# Altium schematic sheet HELIALights2022V1.0Sheet2.SchDoc
size A3; SheetNumber: 2; SheetTotal: 2
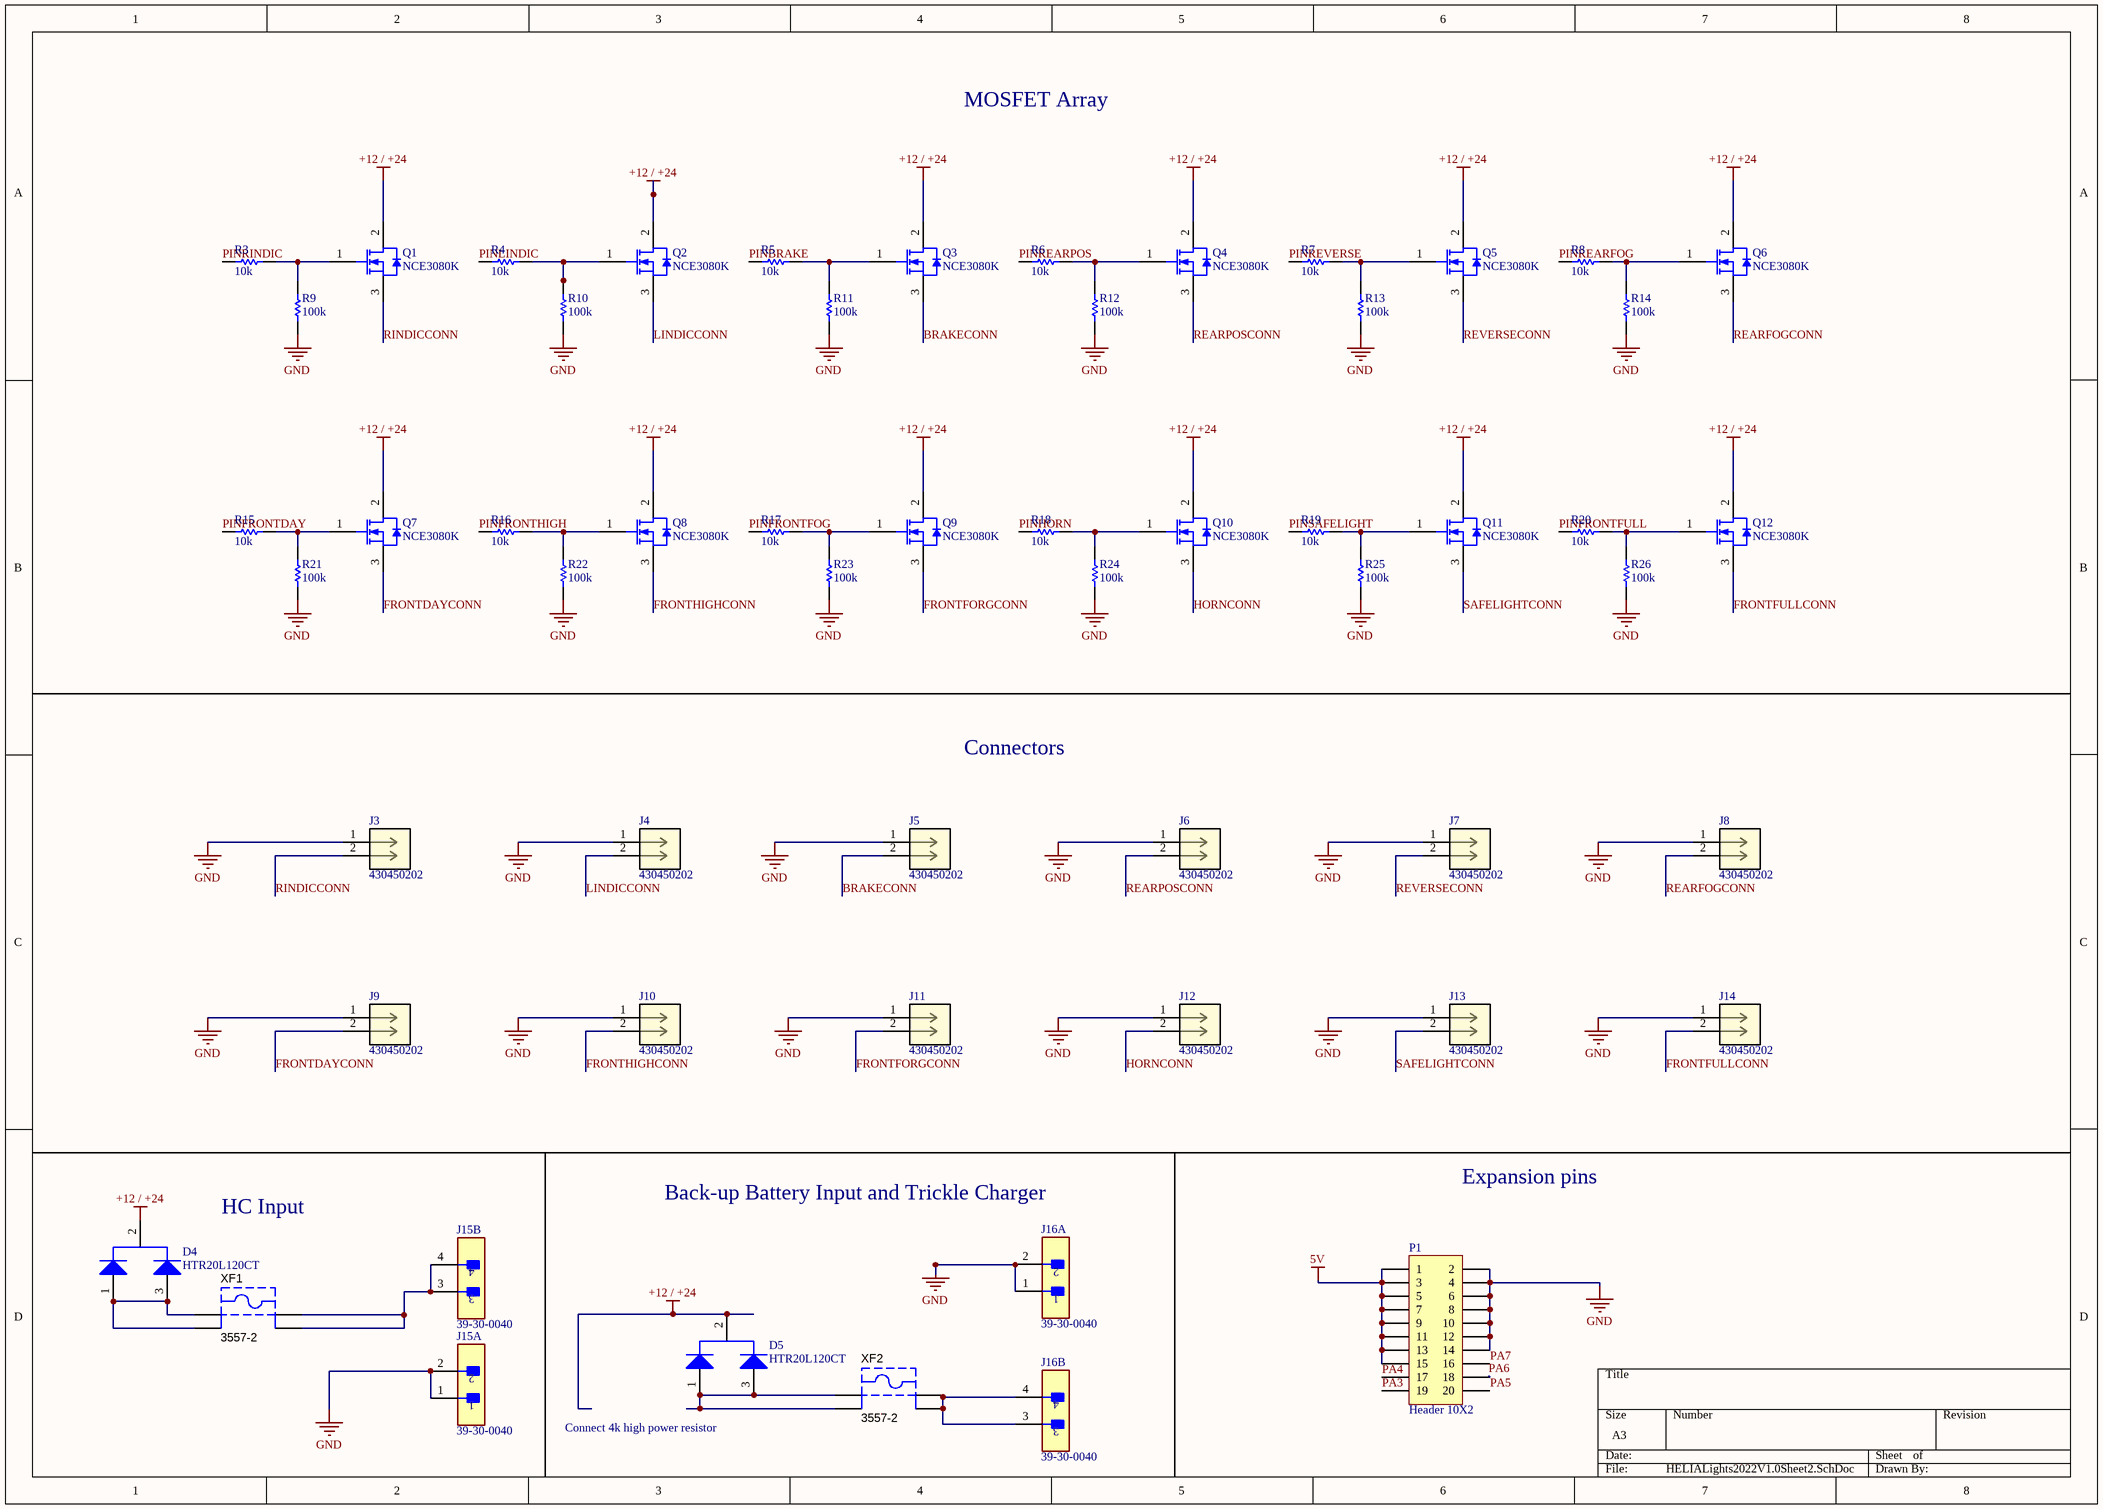
[diagram p0: HELIALights2022V1.0Sheet2.SchDoc]

## Parts
D4  HTR20L120CT  [ONSC-TO-220-3-221A-09]
D5  HTR20L120CT  [ONSC-TO-220-3-221A-09]
J3  430450202  [CON_430450202_MOL]
J4  430450202  [CON_430450202_MOL]
J5  430450202  [CON_430450202_MOL]
J6  430450202  [CON_430450202_MOL]
J7  430450202  [CON_430450202_MOL]
J8  430450202  [CON_430450202_MOL]
J9  430450202  [CON_430450202_MOL]
J10  430450202  [CON_430450202_MOL]
J11  430450202  [CON_430450202_MOL]
J12  430450202  [CON_430450202_MOL]
J13  430450202  [CON_430450202_MOL]
J14  430450202  [CON_430450202_MOL]
J15  39-30-0040  [FP-39-30-0040-MFG]  (parts A,B of 2)
J16  39-30-0040  [FP-39-30-0040-MFG]  (parts A,B of 2)
P1  Header 10X2  [HDR2X10]
Q1  NCE3080K  [INF-PG-TO252-3-313_L]
Q2  NCE3080K  [INF-PG-TO252-3-313_L]
Q3  NCE3080K  [INF-PG-TO252-3-313_L]
Q4  NCE3080K  [INF-PG-TO252-3-313_L]
Q5  NCE3080K  [INF-PG-TO252-3-313_L]
Q6  NCE3080K  [INF-PG-TO252-3-313_L]
Q7  NCE3080K  [INF-PG-TO252-3-313_L]
Q8  NCE3080K  [INF-PG-TO252-3-313_L]
Q9  NCE3080K  [INF-PG-TO252-3-313_L]
Q10  NCE3080K  [INF-PG-TO252-3-313_L]
Q11  NCE3080K  [INF-PG-TO252-3-313_L]
Q12  NCE3080K  [INF-PG-TO252-3-313_L]
R3  10k  [RESC1609X50X30NL8T20]
R4  10k  [RESC1609X50X30NL8T20]
R5  10k  [RESC1609X50X30NL8T20]
R6  10k  [RESC1609X50X30NL8T20]
R7  10k  [RESC1609X50X30NL8T20]
R8  10k  [RESC1609X50X30NL8T20]
R9  100k  [RESC1609X50X30NL8T20]
R10  100k  [RESC1609X50X30NL8T20]
R11  100k  [RESC1609X50X30NL8T20]
R12  100k  [RESC1609X50X30NL8T20]
R13  100k  [RESC1609X50X30NL8T20]
R14  100k  [RESC1609X50X30NL8T20]
R15  10k  [RESC1609X50X30NL8T20]
R16  10k  [RESC1609X50X30NL8T20]
R17  10k  [RESC1609X50X30NL8T20]
R18  10k  [RESC1609X50X30NL8T20]
R19  10k  [RESC1609X50X30NL8T20]
R20  10k  [RESC1609X50X30NL8T20]
R21  100k  [RESC1609X50X30NL8T20]
R22  100k  [RESC1609X50X30NL8T20]
R23  100k  [RESC1609X50X30NL8T20]
R24  100k  [RESC1609X50X30NL8T20]
R25  100k  [RESC1609X50X30NL8T20]
R26  100k  [RESC1609X50X30NL8T20]
XF1  3557-2  [KSTN-3557-2]
XF2  3557-2  [KSTN-3557-2]

## Nets
5V: P1.1 P1.3 P1.5 P1.7 P1.9 P1.11 P1.13 P1.15
+12 / +24: D4.2(K) D5.2(K) Q1.2(DRAIN) Q2.2(DRAIN) Q3.2(DRAIN) Q4.2(DRAIN) Q5.2(DRAIN) Q6.2(DRAIN) Q7.2(DRAIN) Q8.2(DRAIN) Q9.2(DRAIN) Q10.2(DRAIN) Q11.2(DRAIN) Q12.2(DRAIN)
GND: J3.1 J4.1 J5.1 J6.1 J7.1 J8.1 J9.1 J10.1 J11.1 J12.1 J13.1 J14.1 J15.1 J15.2 J16.1 J16.2 P1.2 P1.4 P1.6 P1.8 P1.10 P1.12 P1.14 R9.2 R10.2 R11.2 R12.2 R13.2 R14.2 R21.2 R22.2 R23.2 R24.2 R25.2 R26.2
BRAKECONN: J5.2 Q3.3(SOURCE)
FRONTDAYCONN: J9.2 Q7.3(SOURCE)
FRONTFORGCONN: J11.2 Q9.3(SOURCE)
FRONTFULLCONN: J14.2 Q12.3(SOURCE)
FRONTHIGHCONN: J10.2 Q8.3(SOURCE)
HORNCONN: J12.2 Q10.3(SOURCE)
LINDICCONN: J4.2 Q2.3(SOURCE)
PA3: P1.19
PA4: P1.17
PA5: P1.20
PA6: P1.18
PA7: P1.16
PINBRAKE: R5.2
PINFRONTDAY: R15.2
PINFRONTFOG: R17.2
PINFRONTFULL: R20.2
PINFRONTHIGH: R16.2
PINHORN: R18.2
PINLINDIC: R4.2
PINREARFOG: R8.2
PINREARPOS: R6.2
PINREVERSE: R7.2
PINRINDIC: R3.2
PINSAFELIGHT: R19.2
REARFOGCONN: J8.2 Q6.3(SOURCE)
REARPOSCONN: J6.2 Q4.3(SOURCE)
REVERSECONN: J7.2 Q5.3(SOURCE)
RINDICCONN: J3.2 Q1.3(SOURCE)
SAFELIGHTCONN: J13.2 Q11.3(SOURCE)
NetD4_1: D4.1(A1) D4.3(A2) XF1.1 XF1.2
NetD5_1: D5.1(A1) D5.3(A2) XF2.1 XF2.2
NetJ15_3: J15.3 J15.4 XF1.3 XF1.4
NetJ16_3: J16.3 J16.4 XF2.3 XF2.4
NetQ1_1: Q1.1(GATE) R3.1 R9.1
NetQ2_1: Q2.1(GATE) R4.1 R10.1
NetQ3_1: Q3.1(GATE) R5.1 R11.1
NetQ4_1: Q4.1(GATE) R6.1 R12.1
NetQ5_1: Q5.1(GATE) R7.1 R13.1
NetQ6_1: Q6.1(GATE) R8.1 R14.1
NetQ7_1: Q7.1(GATE) R15.1 R21.1
NetQ8_1: Q8.1(GATE) R16.1 R22.1
NetQ9_1: Q9.1(GATE) R17.1 R23.1
NetQ10_1: Q10.1(GATE) R18.1 R24.1
NetQ11_1: Q11.1(GATE) R19.1 R25.1
NetQ12_1: Q12.1(GATE) R20.1 R26.1

## Notes on the sheet
- MOSFET Array
- Connectors
- Expansion pins
- HC Input
- Back-up Battery Input and Trickle Charger
- Connect 4k high power resistor

## Library data of the parts
D4 D5 = CMP-1055-00618-1: SWITCHMODE(TM) Power Rectifier, 60 V, 30 A, 3-Pin TO-220, Pb-Free, Tube; Manufacturer: On Semiconductor; PartNumber: MBR30H60CTG; Configuration: Common Cathode; IFSM Max (A): 260; RoHS: TRUE; Packing: Tube; ComponentLink3Description: Package Specification; PackageVersion: Rev. AG, 09/2011; DatasheetVersion: Rev. 10; PackageDescription: 3-Pin Flange Mount, Vertical Straight Lead, Body 9.97 x 4.445 mm, Pitch 2.54 mm; ComponentLink1Description: Manufacturer URL; ComponentLink1URL: http://www.onsemi.com/; Mounting Technology: Through Hole; ComponentLink2Description: Datasheet; ComponentLink3URL: http://www.onsemi.com/pub_link/Collateral/221A-09.PDF; ComponentLink2URL: http://www.onsemi.cn/pub_link/Collateral/MBRB30H60CT-D.PDF; PackageReference: TO-220-3-221A-09
J3-J14 = 430450202: No Description Available; Mfr_Name: Molex Connector Corporation; Copyright: Copyright (C) 2022 Ultra Librarian. All rights reserved.; Manufacturer_Part_Number: 430450202; RefDes: RefDes; Type: DEV
J15 J16 = CMP-2000-05600-2: CONN HEADER R/A 4POS 4.2MM; Manufacturer: Molex; Current Rating: 13A; Voltage Rating: 600V; Number Of Contacts: 4; Standoff Height: 0.4mm; Conn Orientation: Right Angle; Conn Gender: Male; Device Class L1: Connectors; Pitch: 4.2mm; Package: 39-30-0040; Octopart: https://octopart.com/39-30-0040-molex-277428; Mouser Description: Headers & Wire Housings 4 CKT R/A HEADER; Temperature Range High: +105°C; Number Of Rows: 2; ComponentLink2Description: Datasheet; ComponentLink2URL: https://www.molex.com/webdocs/datasheets/pdf/en-us/0039300040_PCB_HEADERS.pdf; Manufacturer Part Number: 39-30-0040; Contact Material: Gold,Nickel; Digikey Description: CONN HEADER R/A 4POS 4.2MM; Temperature: -40°C to +105°C; Automotive: No; Device Class L2: Headers and Wire Housings; RoHS: TRUE; Lead Free: Yes; Device Class L3: unset; Category: Conn; Footprint Url: https://www.molex.com/pdm_docs/sd/039300040_sd.pdf; Temperature Range Low: -40°C
P1 = Header 10X2: Header, 10-Pin, Dual row; LatestRevisionDate: 17-Jul-2002; LatestRevisionNote: Re-released for DXP Platform.; Publisher: Altium Limited
Q1-Q12 = CMP-1164-00349-1: N-Channel CoolMOS E6 Power-Transistor, 600 V VDS, 7.3 A ID, -55 to 150 degC, PG-TO252-3-313, Reel, Green; Manufacturer: Infineon; PartNumber: IPD60R600C6; IDpuls (max): 19Â A; VDS (max): 600Â V; VGS(th) (min): 2.5Â V; Ptot (max): 63Â W; Rth: 2Â K/W; VGS(th) (max): 3.5Â V; QG: 20.5Â nC; Green: TRUE; RDS (on) (max): 600Â mOhm; ID (max): 7.3Â A; RthJA (max): 62Â K/W; Polarity: N; Packing: Reel; PackageVersion: Oct-10; ComponentLink3Description: Package Specification; ComponentLink3URL: http://www.infineon.com/dgdl/PG-TO252-3-313-Package_Overview.pdf?folderId=db3a30432b57a660012b81890ade72d2&fileId=db3a30432b57a660012b8193af2872eb; Mounting Technology: Surface Mount; Technology: CoolMOS C6; PackageDescription: 3-Pin Plastic (Green) Transistor Single Outline Package, 6.5 x 6.12 mm Body, 2.28 mm Pitch; ComponentLink2Description: Datasheet; RthJC (max): 2Â K/W; ComponentLink1Description: Manufacturer URL; ComponentLink1URL: http://www.infineon.com/; ComponentLink2URL: http://www.infineon.com/dgdl/IPD60R600C6_2_0.pdf?folderId=db3a30431ff98815012019af55de3f2c&fileId=db3a30432239cccd0122a83152b97d6f; PackageReference: PG-TO252-3-313; DatasheetVersion: Rev. 2.0
R3-R26 = CMP-2000-03816-5: Chip Resistor, 0 Ohm, Jumper, 100 mW, -55 to 155 degC, 0603 (1608 Metric), RoHS, Tape and Reel; Manufacturer: Vishay Semiconductor; Voltage Rating: 75 V; Package Quantity: 5000; DatasheetVersion: 06/2012; Min Operating Temperature: -55 degC; ComponentLink1URL: http://www.vishay.com/; Mounting Technology: Surface Mount; Height: 0.45 mm; ComponentLink1Description: Manufacturer URL; REACH SVHC: Unknown; PackageReference: 0603; Packaging: Tape and Reel; Max Operating Temperature: 155 degC; Mount: Surface Mount; ComponentLink2Description: Datasheet; PackageDescription: 2-Pin Surface Mount Device, Body 1.575 x 0.85 mm; Length: 1.55 mm; ComponentLink2URL: http://www.vishay.com/docs/20035/dcrcwe3.pdf; Pins: 2; RoHSCompliant: true
XF1 XF2 = CMP-2000-05461-1: FUSE HOLDER, PCB MOUNT, 500VAC, 20A, ROHS; Manufacturer: Keystone-Electronics; Number of Circuits: 1; Voltage: 500V; Fuseholder Type: Block; Fuse Type: Blade; Fuse Size: 0.43"Lx0.15"Wx0.64"H(10.92mmx3.81mmx16.25mm); For Use With/Related Products: ATC,ATO257,MINI897; Current Rating: 30A; Datasheet URL: http://datasheet.octopart.com/3557-2-Keystone-datasheet-15715937.pdf; Orientation: Vertical; Family: Fuseholders; Datasheet Version: Apr-13; Contact Finish: TinNickel; Mounting Type: PCB; Series: -; Category: CircuitProtection; Termination Style: PCPin; Contact Material: Brass; Manufacturer URL: http://www.keyelco.com/